# EAGLE design Qwiic GPS-RTK - ublox NEO-M8P-BottomJig (EAGLE 9.2.1)
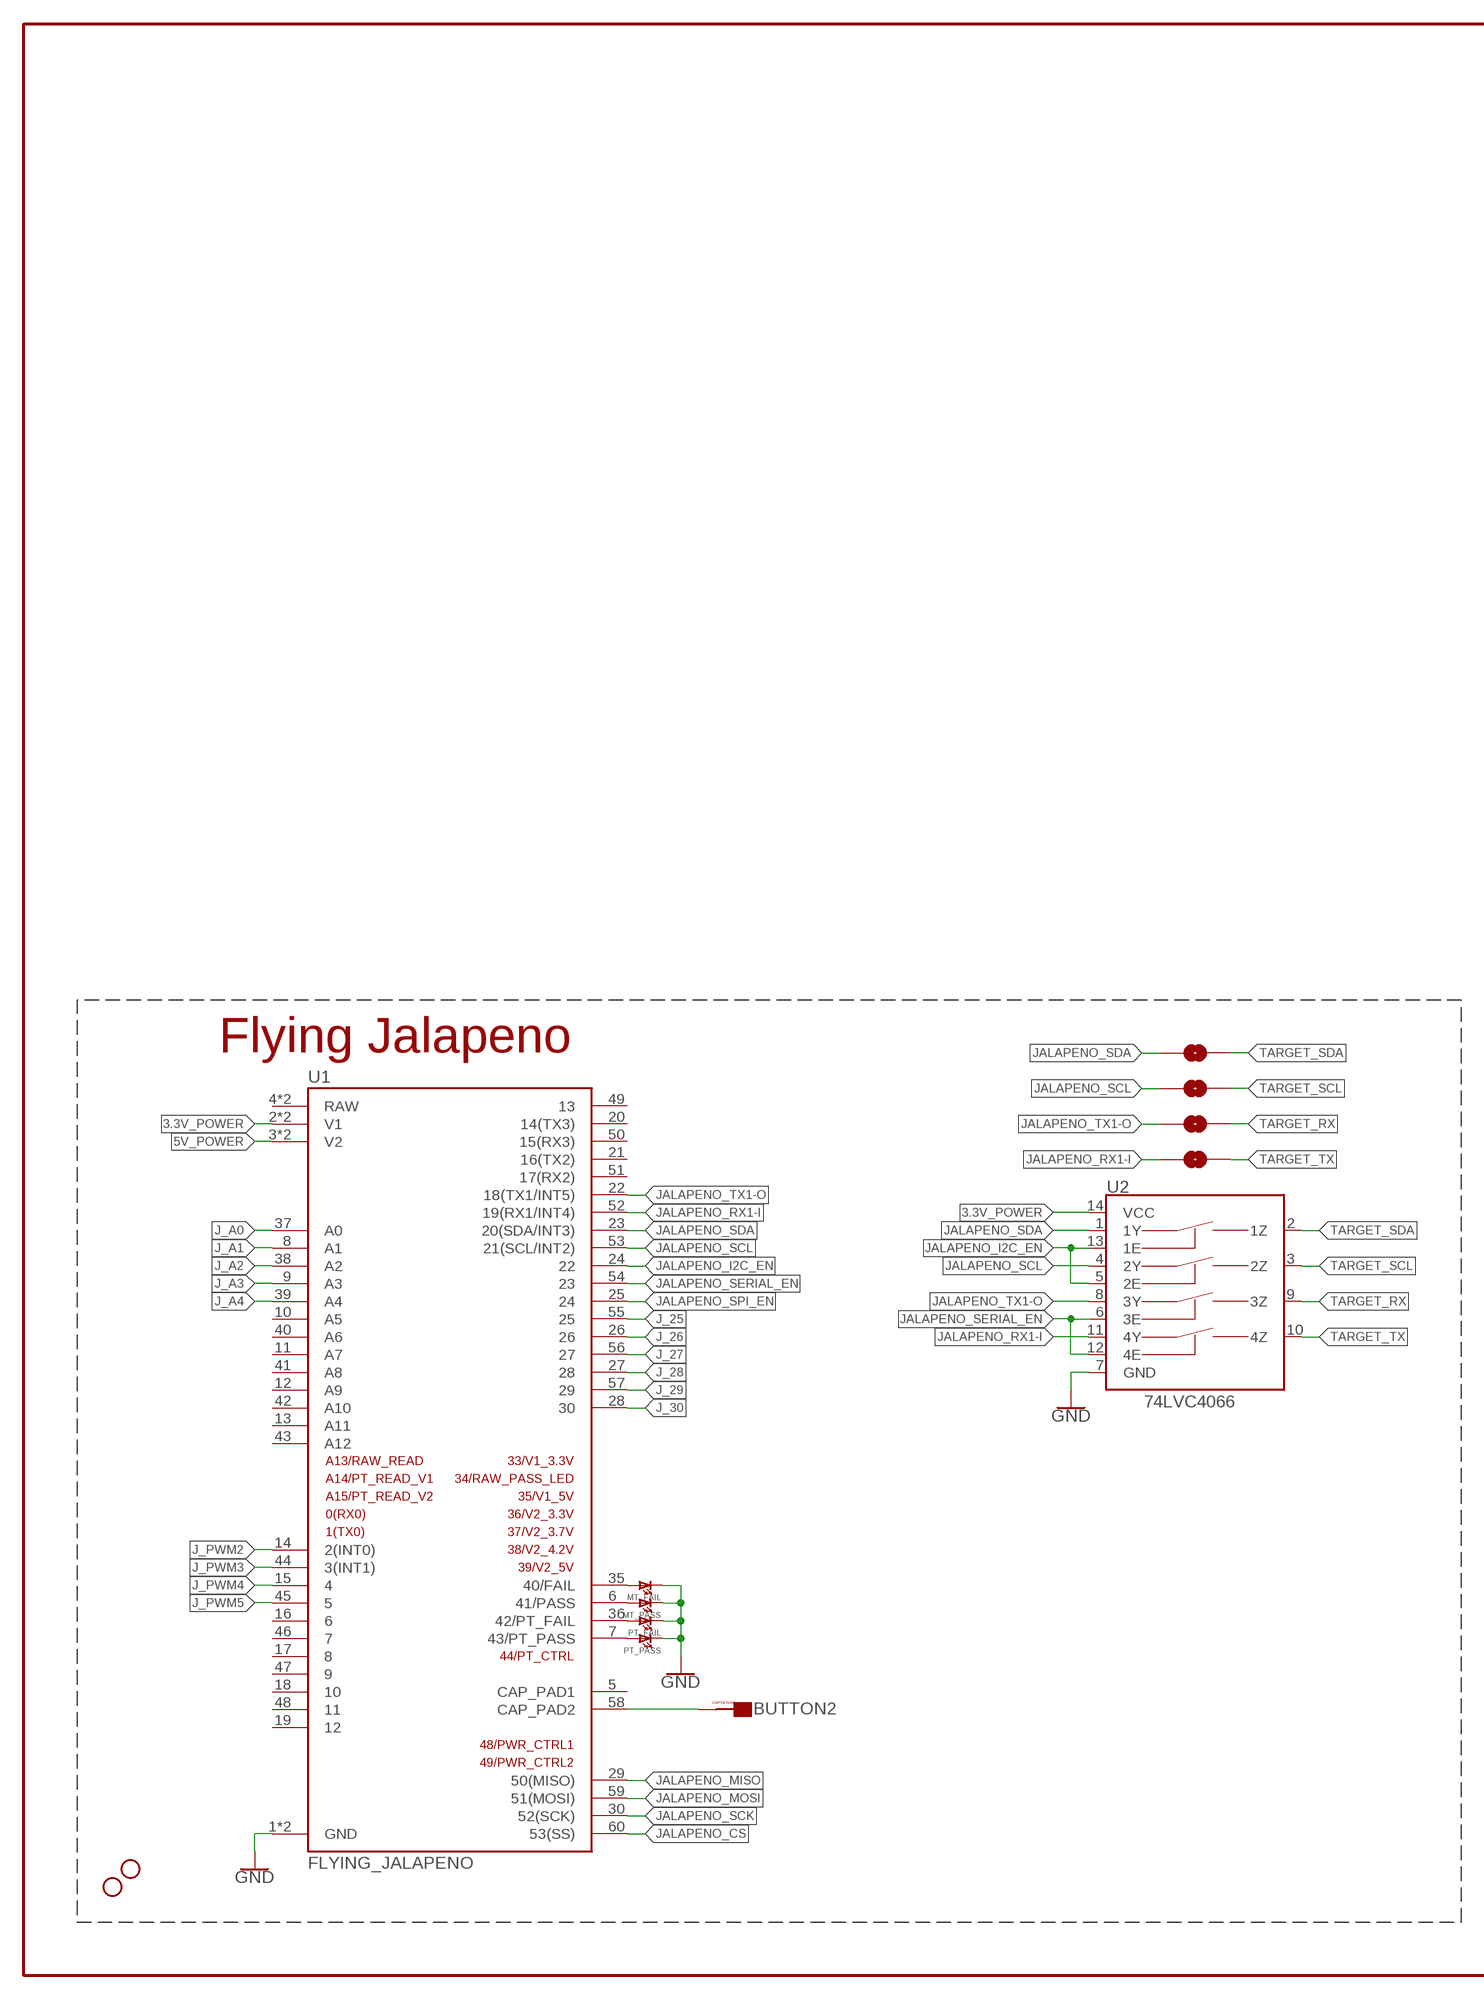
[diagram p0: schematic, sheet 1, part 1 of 2]
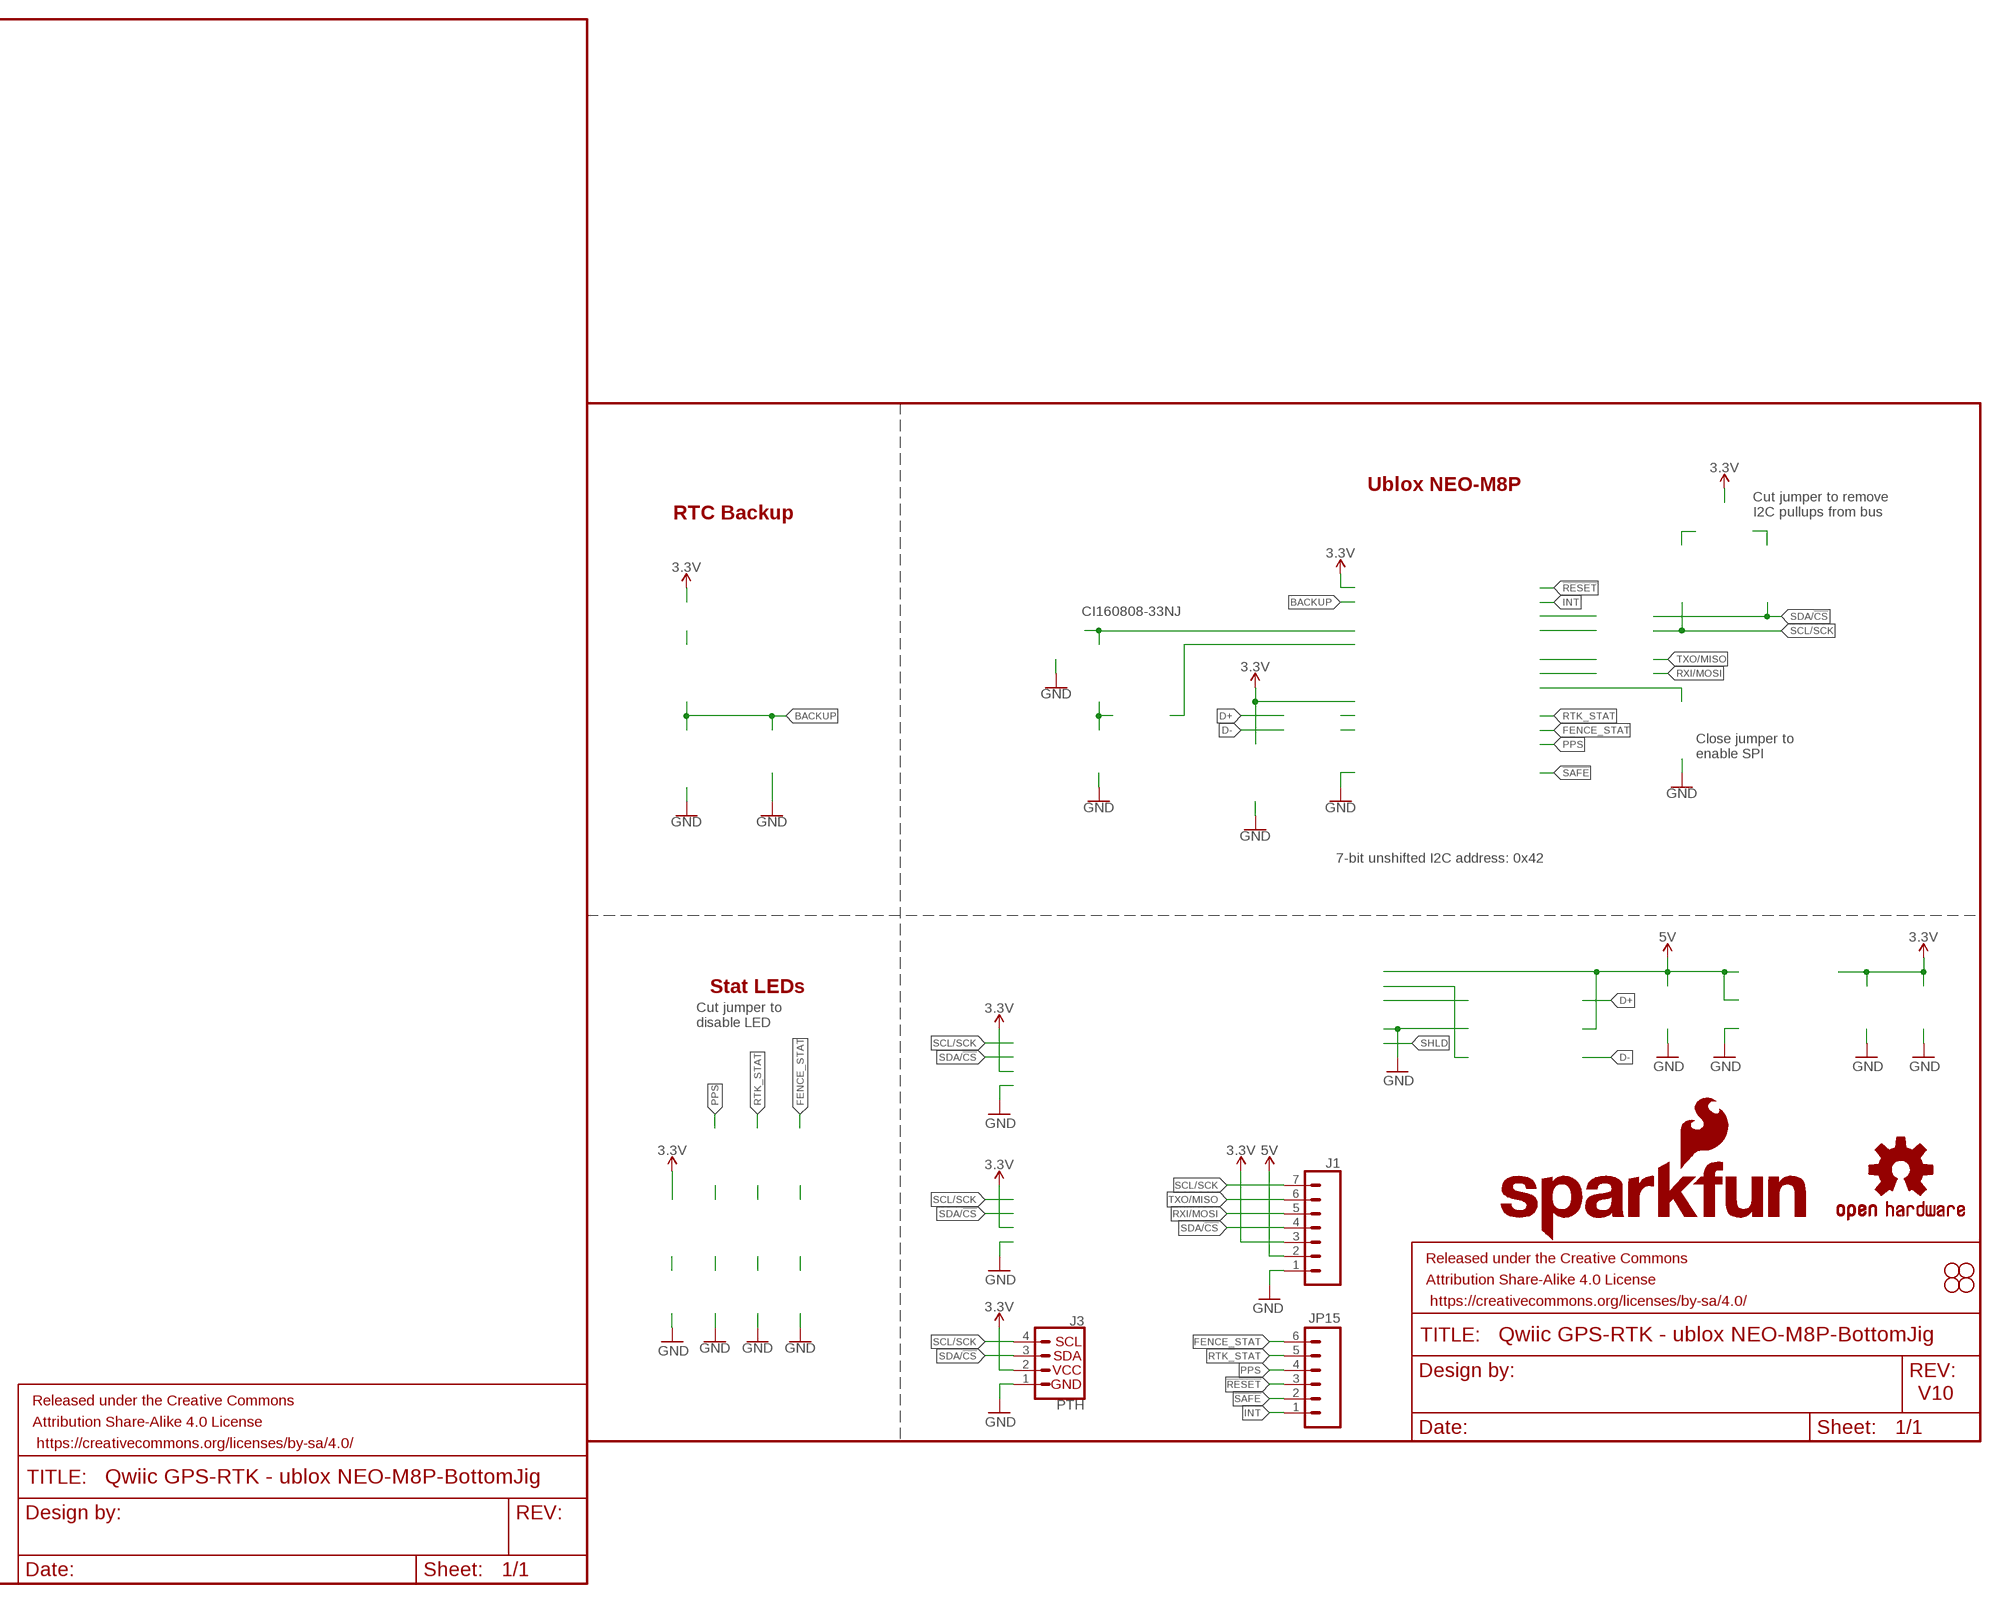
[diagram p1: schematic, sheet 1, part 2 of 2]

## Parts
BUTTON2  CAPSENSE_BUTTON_PAD_ONLY  [CAPSENSE_BUTTON_PADS_ONLY]
FRAME1  FRAME-LETTER  [CREATIVE_COMMONS]
FRAME2  FRAME-LEDGER  [CREATIVE_COMMONS]
H1  STAND-OFF  [STAND-OFF]
H3  STAND-OFF  [STAND-OFF]
J1  CONN_07NO_SILK  [1X07_NO_SILK]
J3  PTH  I2C_STANDARD_NO_SILK  [1X04_NO_SILK]
J_SCL  JUMPER-SMT_2_NO_NO-SILK  [SMT-JUMPER_2_NO_NO-SILK]
J_SCL1  JUMPER-SMT_2_NO_NO-SILK  [SMT-JUMPER_2_NO_NO-SILK]
J_SCL2  JUMPER-SMT_2_NO_NO-SILK  [SMT-JUMPER_2_NO_NO-SILK]
J_SDA  JUMPER-SMT_2_NO_NO-SILK  [SMT-JUMPER_2_NO_NO-SILK]
JP15  M06NO_SILK_FEMALE_PTH  [1X06_NO_SILK]
JP31  STAND-OFF  [STAND-OFF]
JP41  STAND-OFF  [STAND-OFF]
JP91  STAND-OFF  [STAND-OFF]
JP101  STAND-OFF  [STAND-OFF]
LOGO1  OSHW-LOGOMINI  [OSHW-LOGO-MINI]
LOGO2  SFE_LOGO_NAME_FLAME.1_INCH  [SFE_LOGO_NAME_FLAME_.1]
MT_FAIL  LED1206  [LED-1206]
MT_PASS  LED1206  [LED-1206]
PT_FAIL  LED1206  [LED-1206]
PT_PASS  LED1206  [LED-1206]
U1  FLYING_JALAPENO  FLYING_JALAPENO_V3MALE  [FLYING_JALAPENO_V3_M]
U2  74LVC4066  74LVC4066_MUX_1:1_X4  [SO14]

## Nets
3.3V [POWA]: J1.3 J3.2(VCC)
3.3V_POWER [VCC]: U1.2(V1) U1.32(V1) U2.14(VCC)
5V: J1.2
5V_POWER [POWA]: U1.3(V2) U1.33(V2)
!RESET: JP15.3
!SAFE: JP15.2
BUTTON2 [CAPSENSE]: BUTTON2.CAPSENSE_PAD(CAPSENSE) U1.58(CAP_PAD2)
FENCE_STAT: JP15.6
GND: J1.1 J3.1(GND) MT_FAIL.C MT_PASS.C PT_FAIL.C PT_PASS.C U1.1(GND) U1.31(GND) U2.7(GND)
INT: JP15.1
J_25: U1.55
J_26: U1.26
J_27: U1.56
J_28: U1.27
J_29: U1.57
J_30: U1.28
J_A0: U1.37(A0)
J_A1: U1.8(A1)
J_A2: U1.38(A2)
J_A3: U1.9(A3)
J_A4: U1.39(A4)
J_PWM2: U1.14(2(INT0))
J_PWM3: U1.44(3(INT1))
J_PWM4: U1.15
J_PWM5: U1.45
JALAPENO_CS: U1.60(53(SS))
JALAPENO_I2C_EN: U1.24 U2.5(2E) U2.13(1E)
JALAPENO_MISO: U1.29(50(MISO))
JALAPENO_MOSI: U1.59(51(MOSI))
JALAPENO_RX1-I: J_SDA.1 U1.52(19(RX1/INT4)) U2.11(4Y)
JALAPENO_SCK: U1.30(52(SCK))
JALAPENO_SCL: J_SCL.1 U1.53(21(SCL/INT2)) U2.4(2Y)
JALAPENO_SDA: J_SCL2.1 U1.23(20(SDA/INT3)) U2.1(1Y)
JALAPENO_SERIAL_EN: U1.54 U2.6(3E) U2.12(4E)
JALAPENO_SPI_EN: U1.25
JALAPENO_TX1-O: J_SCL1.1 U1.22(18(TX1/INT5)) U2.8(3Y)
N$14: PT_PASS.A U1.7(43/PT_PASS)
N$15: PT_FAIL.A U1.36(42/PT_FAIL)
N$16: MT_PASS.A U1.6(41/PASS)
N$17: MT_FAIL.A U1.35(40/FAIL)
PPS: JP15.4
RTK_STAT: JP15.5
RXI/MOSI: J1.5
SCL/SCK: J1.7 J3.4(SCL)
SDA/!CS: J1.4 J3.3(SDA)
TARGET_RX: J_SCL1.2 U2.9(3Z)
TARGET_SCL: J_SCL.2 U2.3(2Z)
TARGET_SDA: J_SCL2.2 U2.2(1Z)
TARGET_TX: J_SDA.2 U2.10(4Z)
TXO/MISO: J1.6
Unconnected: U1.4(RAW) U1.5(CAP_PAD1) U1.10(A5) U1.11(A7) U1.12(A9) U1.13(A11) U1.16 U1.17 U1.18 U1.19 U1.20(14(TX3)) U1.21(16(TX2)) U1.34(RAW) U1.40(A6) U1.41(A8) U1.42(A10) U1.43(A12) U1.46 U1.47 U1.48 U1.49 U1.50(15(RX3)) U1.51(17(RX2))

## Notes on the sheet
- Ublox NEO-M8P
- RTC Backup
- Cut jumper to remove 
  I2C pullups from bus
- CI160808-33NJ
- Close jumper to
  enable SPI
- Flying Jalapeno
- 7-bit unshifted I2C address: 0x42
- Stat LEDs
- Cut jumper to 
  disable LED
- V10

## Library data of the parts
BUTTON2 = Testing:CAPSENSE_BUTTON_PAD_ONLY
FRAME1 = SparkFun-Aesthetics:FRAME-LETTER: Schematic Frame - Letter Standard 8.5x11 US Letter frame
FRAME2 = SparkFun-Aesthetics:FRAME-LEDGER: Schematic Frame - Ledger Standard 11x14 US Ledger frame
H1 H3 = SparkFun-Hardware:STAND-OFF: Stand Off
J1 = SparkFun-Connectors:CONN_07: Multi connection point. Often used as Generic Header-pin footprint for 0.1 inch spaced/style header connections On any of the 0.1 inch spaced packages, you can populate with these: Break Away Headers - Straight <https://www.sparkfun.com/products/116> (PRT-00116) Break Away Male Headers - Right Angle <https://www.sparkfun.com/products/553> (PRT-00553) Female Headers <https://www.sparkfun.com/products/115> (PRT-00115) Break Away Headers - Machine Pin <https://www.sparkfun.com/products/117> (PRT-00117) Break Away Female Headers - Swiss Machine Pin <https://www.sparkfun.com/products/743> (PRT-00743) For SCREWTERMINALS and SPRING TERMINALS visit here: Screw Terimnals on SparkFun.com <https://www.sparkfun.com/search/results?term=Screw+Terminals> (5mm/3.5mm/2.54mm spacing) This device is also useful as a general connection point to wire up your design to another part of your project. Our various solder wires solder well into these plated through hole pads. Hook-Up Wire - Assortment (Stranded, 22 AWG) <https://www.sparkfun.com/products/11375> (PRT-11375) Hook-Up Wire - Assortment (Solid Core, 22 AWG) <https://www.sparkfun.com/products/11367> (PRT-11367) View the entire wire category on our website here <https://www.sparkfun.com/categories/141> Special notes: Molex polarized connector foot print use with SKU : PRT-08231 with associated crimp pins and housings. 1MM SMD Version SKU: PRT-10208 NOTES ON THE VARIANTS LOCK and LOCK_LONGPADS... This footprint was designed to help hold the alignment of a through-hole component (i.e. 6-pin header) while soldering it into place. You may notice that each hole has been shifted either up or down by 0.005 of an inch from it's more standard position (which is a perfectly straight line). This slight alteration caused the pins (the squares in the middle) to touch the edges of the holes. Because they are alternating, it causes a "brace" to hold the component in place. 0.005 has proven to be the perfect amount of "off-center" position when using our standard breakaway headers. Although looks a little odd when you look at the bare footprint, once you have a header in there, the alteration is very hard to notice. Also,if you push a header all the way into place, it is covered up entirely on the bottom side.
J3 = SparkX:I2C_STANDARD: SparkFun I2C Standard Pinout Header SparkFun has standardized on a pinout for all I2C based sensor breakouts. This pinout allows I2C boards to be plugged directly into the headers on Arduino Uno compatible boards, and to be daisy chained easily. Example SparkFun Products: SparkFun Atmospheric Sensor Breakout - BME280 <https://www.sparkfun.com/products/13676> SparkFun Altitude/Pressure Sensor Breakout - MPL3115A2 <https://www.sparkfun.com/products/11084> SparkFun TOF Range Finder Sensor - VL6180 <https://www.sparkfun.com/products/12785>
J_SCL J_SCL1 J_SCL2 J_SDA = SparkFun-Jumpers:JUMPER-SMT_2_NO: Normally open jumper This jumper has two pads in close proximity to each other. Apply solder to close the connection. Round pads are easier to solder for beginners, but are a lot larger. SparkFun Product that uses the round pads: SparkFun EL Sequencer <https://www.sparkfun.com/products/12781>
JP15 = SparkFun-Connectors:M06: Header 6 Standard 6-pin 0.1" header. Use with straight break away headers (SKU : PRT-00116), right angle break away headers (PRT-00553), swiss pins (PRT-00743), machine pins (PRT-00117), and female headers (PRT-00115). Molex polarized connector foot print use with SKU : PRT-08094 with associated crimp pins and housings. NOTES ON THE VARIANTS LOCK and LOCK_LONGPADS... This footprint was designed to help hold the alignment of a through-hole component (i.e. 6-pin header) while soldering it into place. You may notice that each hole has been shifted either up or down by 0.005 of an inch from it's more standard position (which is a perfectly straight line). This slight alteration caused the pins (the squares in the middle) to touch the edges of the holes. Because they are alternating, it causes a "brace" to hold the component in place. 0.005 has proven to be the perfect amount of "off-center" position when using our standard breakaway headers. Although looks a little odd when you look at the bare footprint, once you have a header in there, the alteration is very hard to notice. Also,if you push a header all the way into place, it is covered up entirely on the bottom side. This idea of altering the position of holes to aid alignment will be further integrated into the Sparkfun Library for other footprints. It can help hold any component with 3 or more connection pins.; PROD_ID: CONN-08437
JP31 JP41 JP91 JP101 = SparkFun:STAND-OFF: Stand Off
LOGO1 = SparkFun-Aesthetics:OSHW-LOGO: Open-Source Hardware (OSHW) Logo This logo indicates the piece of hardware it is found on incorporates a OSHW license and/or adheres to the definition of open source hardware found here: http://freedomdefined.org/OSHW
LOGO2 = SparkFun-Aesthetics:SFE_LOGO_NAME_FLAME: SparkFun Font Logo w/ Flame This is the SparkFun full logo. The logo on the schematic will always be the same size; the package variant is the height of the flame part of the logo. Default layer for the logo on the board is tSilk.
MT_FAIL MT_PASS PT_FAIL PT_PASS = Testing:LED: LEDs Standard schematic elements and footprints for 5mm, 3mm, 1206, and 0603 sized LEDs. 5mm - Spark Fun Electronics SKU : COM-00529 (and others)
U1 = Testing:FLYING_JALAPENO_V3
U2 = Testing:74LVC4066_MUX_1:1_X4

## Net classes
1 VCC: width 0.381 mm
2 POWA: width 0.61 mm
3 CAPSENSE: width 0.508 mm

## Board
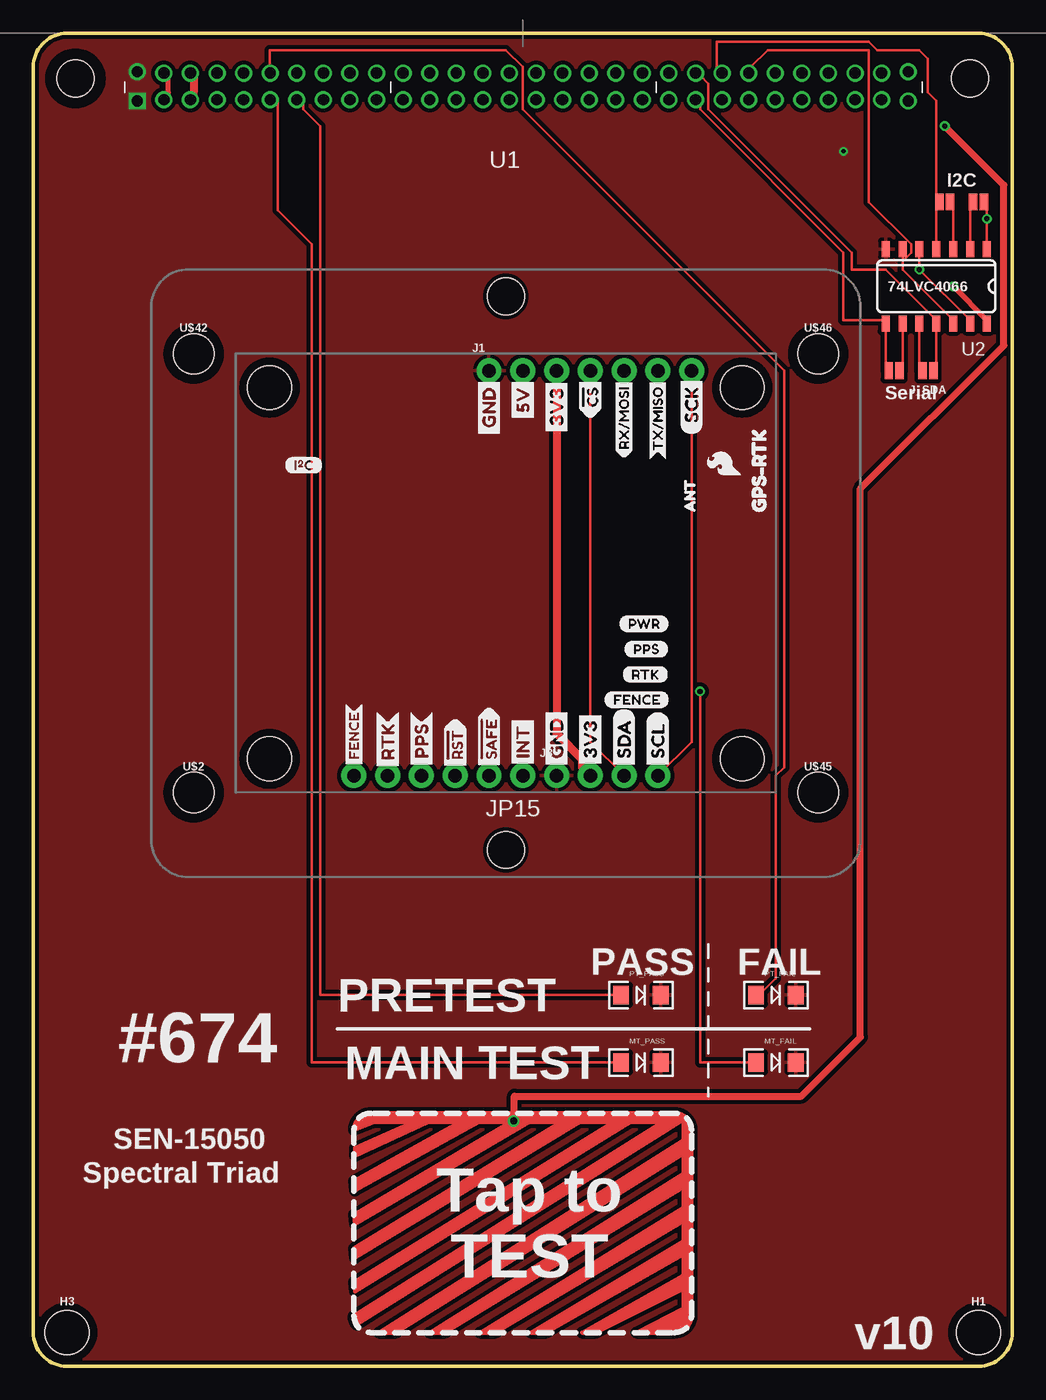
[diagram p2: board, top side]
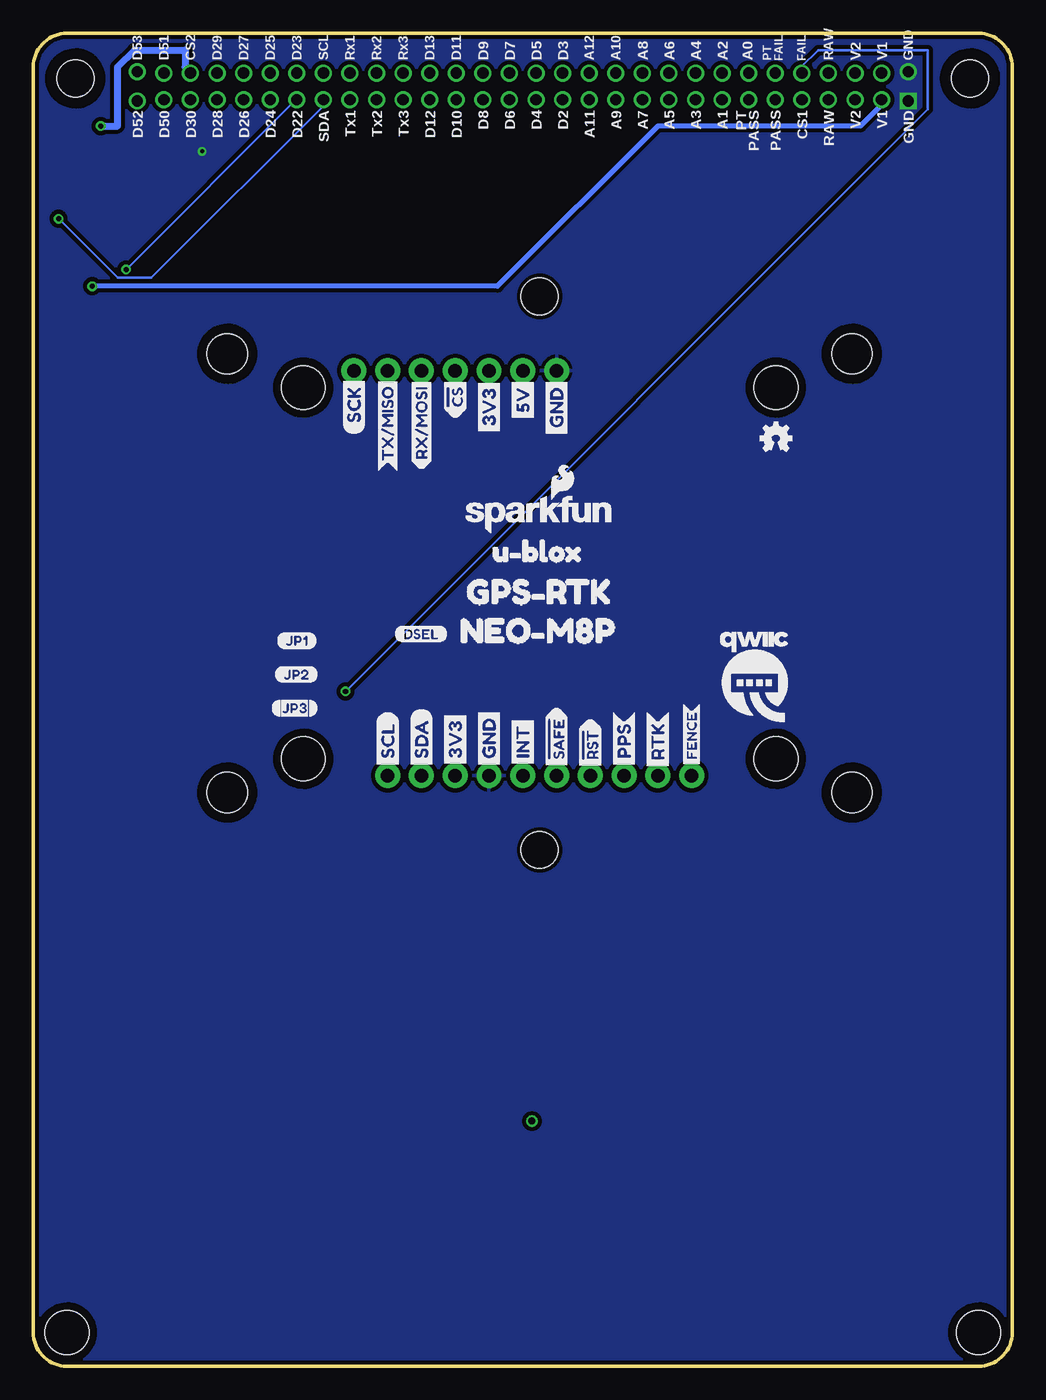
[diagram p3: board, bottom side, seen from below]

Size 73.66 x 100.33 mm. Coordinates in mm from the lower left corner, seen from the top.
Outline: 2.54,100.33 71.12,100.33 arc-90 73.66,97.79 73.66,2.54 arc-90 71.12,0 2.54,0 arc-90 0,2.54 0,97.79 arc-90 2.54,100.33
Copper layers (1*16): Top 0.035mm / dielectric 1.5mm / Bottom 0.035mm
Design rules "SparkFun-2-layer-TIGHT": minimum track width 7mil, minimum drill 15mil, track to track 7mil, track to pad 7mil, pad to pad 7mil, via to via 7mil, smd to smd 7mil, copper to edge 7mil, drill to drill 7mil, minimum pad ring 7mil, minimum via ring 7mil, stop-mask expansion 4mil, vias tented up to drill 25mil, thermal gap 10mil

### Footprints (pad centres in the part's own frame; a part is rotated, then mirrored left to right if it is on the bottom)
CAPSENSE_BUTTON_PADS_ONLY = drill 0.508: CAPSENSE_PAD -0.686,7.036
STAND-OFF = hole 3.302: 0,0
1X07_NO_SILK = drill 1.016 pad 1.88: 1 0,0; 2 2.54,0; 3 5.08,0; 4 7.62,0; 5 10.16,0; 6 12.7,0; 7 15.24,0
1X04_NO_SILK = drill 1.016 pad 1.88: 1 0,0; 2 2.54,0; 3 5.08,0; 4 7.62,0
SMT-JUMPER_2_NO_NO-SILK = smd 0.635 x 1.27: 1 -0.406,0; 2 0.406,0
1X06_NO_SILK = drill 1.016 pad 1.88: 1 0,0; 2 2.54,0; 3 5.08,0; 4 7.62,0; 5 10.16,0; 6 12.7,0
LED-1206 = smd 1.2 x 1.4: A -1.5,0; C 1.5,0
FLYING_JALAPENO_V3_M = drill 0.85 square: 1 -29,-5.1 | drill 0.85: 2 -27,-5; 3 -25,-5; 4 -23,-5; 5 -21,-5; 6 -19,-5; 7 -17,-5; 8 -15,-5; 9 -13,-5; 10 -11,-5; 11 -9,-5; 12 -7,-5; 13 -5,-5; 14 -3,-5; 15 -1,-5; 16 1,-5; 17 3,-5; 18 5,-5; 19 7,-5; 20 9,-5; 21 11,-5; 22 13,-5; 23 15,-5; 24 17,-5; 25 19,-5; 26 21,-5; 27 23,-5; 28 25,-5; 29 27,-5; 30 29,-5.1; 31 -29,-2.9; 32 -27,-3; 33 -25,-3; 34 -23,-3; 35 -21,-3; 36 -19,-3; 37 -17,-3; 38 -15,-3; 39 -13,-3; 40 -11,-3; 41 -9,-3; 42 -7,-3; 43 -5,-3; 44 -3,-3; 45 -1,-3; 46 1,-3; 47 3,-3; 48 5,-3; 49 7,-3; 50 9,-3; 51 11,-3; 52 13,-3; 53 15,-3; 54 17,-3; 55 19,-3; 56 21,-3; 57 23,-3; 58 25,-3; 59 27,-3; 60 29,-2.9 | hole 2.794: 33.655,-3.404; -33.655,-3.404
SO14 = smd 0.6 x 1.2: 1 -3.175,-2.8; 2 -1.905,-2.8; 3 -0.635,-2.8; 4 0.635,-2.8; 5 1.905,-2.8; 6 3.175,-2.8; 7 4.445,-2.8; 8 4.445,2.8; 9 3.175,2.8; 10 1.905,2.8; 11 0.635,2.8; 12 -0.635,2.8; 13 -1.905,2.8; 14 -3.175,2.8
STAND-OFF-TIGHT = hole 3.048: 0,0
NUBBIN_LOCKER = hole 2.794: 0,0

### Placement (x,y rotation side)
BUTTON2  36.83,11.43 0 top
FRAME1  -31.75,-17.78 0 top  (outside the outline)
FRAME2  -31.75,-26.67 0 top  (outside the outline)
H1  71.12,2.54 0 top
H3  2.54,2.54 0 top
J1  34.29,74.93 0 top
J3  39.37,44.45 0 top
J_SCL  68.58,87.63 0 top
J_SCL1  64.77,74.93 0 top
J_SCL2  71.12,87.63 180 top
J_SDA  67.31,74.93 180 top
JP15  36.83,44.45 180 top
JP31  17.78,73.66 0 top
JP41  53.34,73.66 0 top
JP91  17.78,45.72 0 top
JP101  53.34,45.72 0 top
LOGO1  17.78,69.85 0 bottom
LOGO2  41.53,62.61 0 bottom
MT_FAIL  55.88,22.86 0 top
MT_PASS  45.72,22.86 0 top
PT_FAIL  55.88,27.94 0 top
PT_PASS  45.72,27.94 0 top
U1  36.83,100.33 0 top
U2  68.58,81.28 180 top
U$1  [SDA-[)]  44.45,44.83 90 top
U$2  [STAND-OFF-TIGHT]  12.06,43.18 0 top
U$3  [SCL-[)]  46.99,44.83 90 top
U$4  [SDA-[)]  44.45,44.83 90 bottom
U$5  [SCL-[)]  46.99,44.83 90 bottom
U$6  [3V3-04]  41.91,44.83 90 top
U$7  [3V3-04]  41.91,44.83 90 bottom
U$8  [GND-04]  39.37,44.83 90 top
U$9  [GND-04]  39.37,44.83 90 bottom
U$10  [I_SUPER2_C-()-03]  18.92,67.82 0 top
U$11  [FENCE2]  42.93,50.16 0 top
U$12  [JP20]  55.5,52.07 0 bottom
U$13  [RTK1]  44.32,52.07 0 top
U$14  [FENCE0]  24.13,44.96 90 top
U$15  [INT8]  36.83,44.83 90 top
U$16  [INT8]  36.83,44.83 90 bottom
U$17  [FENCE0]  24.13,44.96 90 bottom
U$18  [PWR-()-03]  44.07,55.88 0 top
U$19  [5V]  36.83,70.87 90 top
U$20  [5V]  36.83,70.87 90 bottom
U$21  [GPS#RTK0]  54.61,63.37 90 top
U$22  [U#BLOX3]  40.51,61.34 0 bottom
U$23  [CS#-<]]  41.91,71.12 90 top
U$24  [CS#-<]]  41.91,71.12 90 bottom
U$25  [JP10]  55.37,54.61 0 bottom
U$26  [RX#MOSI2]  44.45,68.33 90 top
U$27  [DSEL0]  46.48,55.12 0 bottom
U$28  [RTK1]  26.67,44.7 90 bottom
U$29  [RTK1]  26.67,44.7 90 top
U$30  [QWIIC-LOGO-MEDIUM]  19.43,51.94 0 bottom
U$31  [RX#MOSI3]  44.45,67.44 90 bottom
U$32  [JP32]  55.75,49.53 0 bottom
U$33  [SFE_LOGO_FLAME_.1]  53.59,66.8 90 top
U$34  [TX#MISO0]  46.99,68.2 90 top
U$35  [#RST3]  31.75,44.58 90 top
U$36  [#RST3]  31.75,44.58 90 bottom
U$37  [TX#MISO1]  46.99,67.31 90 bottom
U$38  [SCK-(]-04]  49.53,70.1 90 top
U$39  [#SAFE1]  34.29,44.58 90 top
U$40  [#SAFE1]  34.29,44.58 90 bottom
U$41  [SCK-(]-04]  49.53,70.1 90 bottom
U$42  [STAND-OFF-TIGHT]  12.06,76.2 0 top
U$43  [PPS5]  29.21,44.83 90 top
U$44  [PPS5]  29.21,44.83 90 bottom
U$45  [STAND-OFF-TIGHT]  59.06,43.18 0 top
U$46  [STAND-OFF-TIGHT]  59.06,76.2 0 top
U$47  [NUBBIN_LOCKER]  35.56,38.86 0 top
U$48  [NUBBIN_LOCKER]  35.56,80.52 0 top
U$52  [PPS0]  44.45,53.98 0 top
U$53  [NEO#M8P3]  43.18,55.37 0 bottom
U$54  [GPS#RTK1]  42.67,58.29 0 bottom
U$55  [ANT0]  49.4,63.63 90 top
U$60  [3V3-04]  39.37,69.85 90 bottom
U$61  [3V3-04]  39.37,69.85 90 top
U$62  [GND-04]  34.29,69.72 90 bottom
U$63  [GND-04]  34.29,69.72 90 top

### Tracks (layer width: path | path; a pad name or v marks a point on that pad's centre or on a via)
3.3V
  Top 0.61: J3.2 41.27,45.09 41.27,45.72 39.37,47.62 J1.3
3.3V_POWER  (via drill 0.38)
  Top 0.381: v69.22,81.28 71.75,78.74 U2.14 | U1.32 10.16,97.16 10.16,95.89 U1.2
  Bottom 0.381: v69.22,81.28 38.73,81.28 26.67,93.34 11.43,93.34 9.53,95.25 U1.2
5V_POWER
  Top 0.61: U1.3 12.06,95.89 12.06,97.16 U1.33
BUTTON2  (via drill 0.38)
  Top 0.508: v68.58,93.34 73.03,88.9 73.03,76.83 62.23,66.04 62.23,24.77 57.78,20.32 36.2,20.32 36.2,18.41 BUTTON2.CAPSENSE_PAD
  Bottom 0.508: v68.58,93.34 67.31,93.34 67.31,97.79 66.04,99.06 62.23,99.06 62.23,97.79 U1.58
GND  (via drill 0.3)
  other vias: 60.96,91.44
  pour Top (isolate 0.305): 0,100.33 73.66,100.33 73.66,0 0,0
  pour Bottom (isolate 0.305): 0,100.33 73.66,100.33 73.66,0 0,0
JALAPENO_I2C_EN  (via drill 0.38)
  Top 0.178: U2.5 v66.67,82.55 70.48,78.74 U2.13
  Bottom 0.178: v66.67,82.55 53.97,95.25 U1.24
JALAPENO_RX1-I
  Top 0.178: J_SDA.1 67.95,74.93 U2.11 67.95,78.74 64.14,82.55 61.59,82.55 61.59,83.82 50.8,94.61 50.8,96.52 50.17,97.16 U1.52
JALAPENO_SCL
  Top 0.178: 67.95,87.63 U2.4 | 67.95,87.63 67.95,95.25 67.31,95.89 67.31,98.42 66.67,99.06 63.5,99.06 62.86,99.69 51.44,99.69 51.44,97.79 U1.53 | 67.95,87.63 J_SCL.1
JALAPENO_SDA  (via drill 0.38)
  Top 0.178: U2.1 v71.75,86.36 71.75,87.63 J_SCL2.1
  Bottom 0.178: v71.75,86.36 67.31,81.92 64.77,81.92 51.44,95.25 U1.23
JALAPENO_SERIAL_EN
  Top 0.178: U2.6 65.41,83.19 | 65.41,83.19 65.41,82.55 69.22,78.74 U2.12 | 65.41,83.19 66.04,83.82 66.04,84.45 62.86,87.63 62.86,99.06 55.25,99.06 53.97,97.79 U1.54
JALAPENO_TX1-O
  Top 0.178: J_SCL1.1 64.14,74.93 U2.8 64.14,78.74 60.96,78.74 60.96,83.82 50.17,94.61 50.17,95.25 U1.22
N$14
  Top 0.178: PT_PASS.A 21.59,27.94 21.59,93.34 20.32,94.61 20.32,95.25 U1.7
N$15
  Top 0.178: PT_FAIL.A 54.61,27.94 55.88,29.21 55.88,44.45 56.52,45.09 56.52,74.93 36.83,94.61 36.83,97.79 35.56,99.06 17.78,99.06 17.78,97.79 U1.36
N$16
  Top 0.178: MT_PASS.A 20.95,22.86 20.95,84.45 18.41,87 18.41,95.25 U1.6
N$17  (via drill 0.38)
  Top 0.178: MT_FAIL.A 50.17,22.86 v50.17,50.8
  Bottom 0.178: v50.17,50.8 6.35,94.61 6.35,99.06 14.6,99.06 15.87,97.79 U1.35
SCL/SCK
  Top 0.178: J3.4 49.53,46.99 J1.7
SDA/!CS
  Top 0.178: J3.3 41.91,46.99 J1.4
TARGET_RX
  Top 0.178: U2.9 65.41,74.93 J_SCL1.2
TARGET_SCL
  Top 0.178: U2.3 69.22,87.63 J_SCL.2
TARGET_SDA
  Top 0.178: U2.2 70.48,87.63 J_SCL2.2
TARGET_TX
  Top 0.178: U2.10 66.67,74.93 J_SDA.2

### Text on the board
tPlace: I2C | Serial | PASS | FAIL | PRETEST | #674 | MAIN TEST | SEN-15050 | Spectral Triad | Tap to / TEST | v10
Measures: Measurements in inches